# EAGLE design 12V_switching (EAGLE 7.7.0)
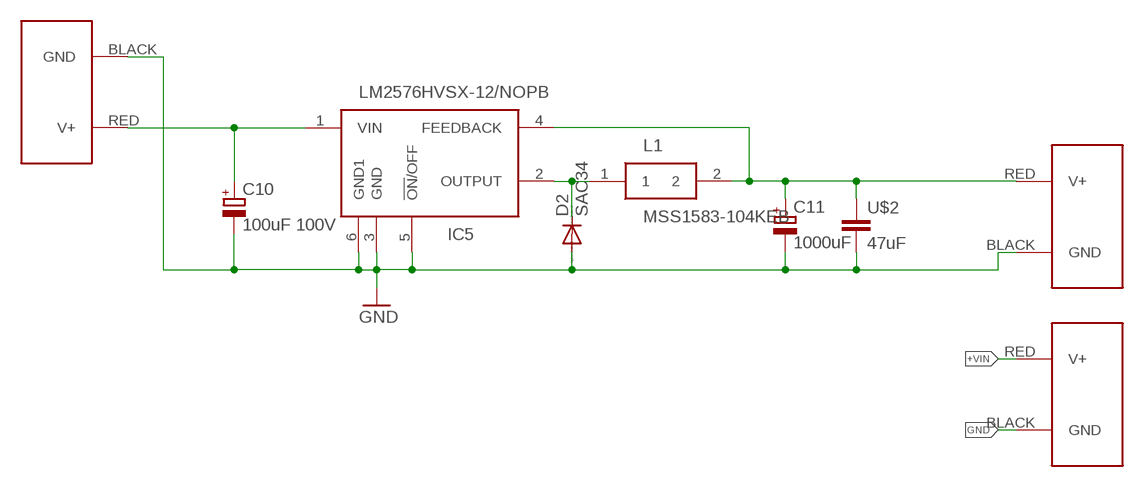
[diagram p0: schematic, sheet 1]

## Parts
C10  100uF 100V  CPOL-EU  [UD-10X10_NICHICON]
C11  1000uF  CPOL-EU  [UD-10X10_NICHICON]
D2  SAC34  DIODE-DO-214AC  [DO-214AC]
IC5  LM2576HVSX-12/NOPB  LM2576D2TR4-012G  [TO263-5]
J1  POWERPOLE_POWER45A  [POWERPOLE_PAIR_45A]
J2  POWERPOLE_POWER45A  [POWERPOLE_PAIR_45A]
J3  POWERPOLE_POWER45A  [POWERPOLE_PAIR_45A]
L1  MSS1583-104KEB  [INDPM150150X860N]
U$2  47uF  C-EU'1206'  [C1206]

## Nets
12VOUT: D2.C IC5.2(OUTPUT) L1.1
+12V: C11.+ IC5.4(FEEDBACK) J2.RED(V+) L1.2 U$2.1
+VIN [+12V]: C10.+ IC5.1(VIN) J1.RED(V+) J3.RED(V+)
GND: C10.- C11.- D2.A IC5.3(GND) IC5.5(!ON!/OFF) IC5.6(GND1) J1.BLACK(GND) J2.BLACK(GND) J3.BLACK(GND) U$2.2

## Library data of the parts
C10 C11 = rti:CPOL-EU
D2 = diode:DIODE-: DIODE
IC5 = LM2576:LM2576D2TR4-012G: Voltage Regulators - Switching Regulators 12V 3A Buck PWM Source: Datasheet <https://componentsearchengine.com/Datasheets/1/LM2576D2TR4-012G.pdf>; DESCRIPTION: Voltage Regulators - Switching Regulators 5V 3A Buck PWM; HEIGHT: mm; MANUFACTURER_NAME: ON Semiconductor; MANUFACTURER_PART_NUMBER: LM2576D2TR4-012G; MOUSER_PART_NUMBER: LM2576HVSX-12/NOPB; MOUSER_PRICE-STOCK: https://www.mouser.com/Search/Refine.aspx?Keyword=863-LM2576D2TR4-5G; MPN: LM2576HVSX-12/NOPB
J1-J3 = powerpoles:POWERPOLE_POWER: Anderson Powerpole Power Connector using ameteur radio standard layout
L1 = MSS1583-104KEB:MSS1583-104KEB: Fixed Inductors MSS1583 SMT Power 0.103Ohms 100uH Source: Datasheet <https://componentsearchengine.com/Datasheets/1/MSS1583-104KEB.pdf>; DESCRIPTION: Fixed Inductors MSS1583 SMT Power 0.103Ohms 100uH; HEIGHT: 8.6mm; MANUFACTURER_NAME: COILCRAFT; MANUFACTURER_PART_NUMBER: MSS1583-104KEB; MOUSER_PART_NUMBER: 994-MSS1583-104KEB; MOUSER_PRICE-STOCK: https://www.mouser.com/Search/Refine.aspx?Keyword=994-MSS1583-104KEB
U$2 = rti:C-EU

## Net classes
0 default: width 0.254 mm, drill 0.3 mm, clearance 0.203 mm
1 +12V: width 0.406 mm, drill 0.3 mm, clearance 0.203 mm
2 GND: width 0.254 mm, drill 0.3 mm, clearance 0.152 mm

## Board
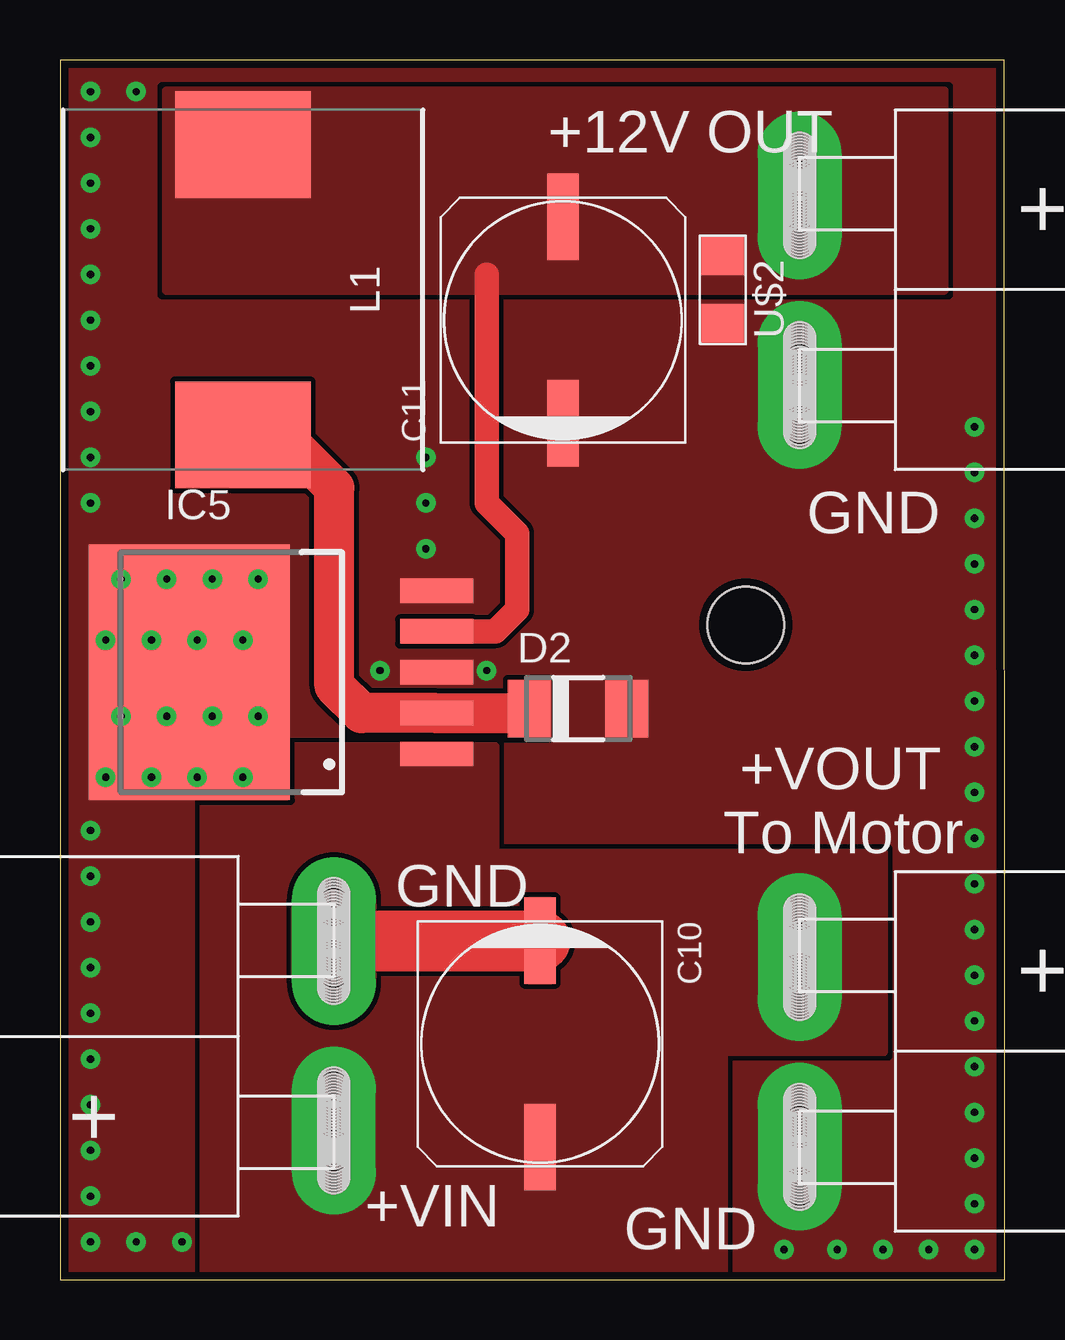
[diagram p1: board, top side]
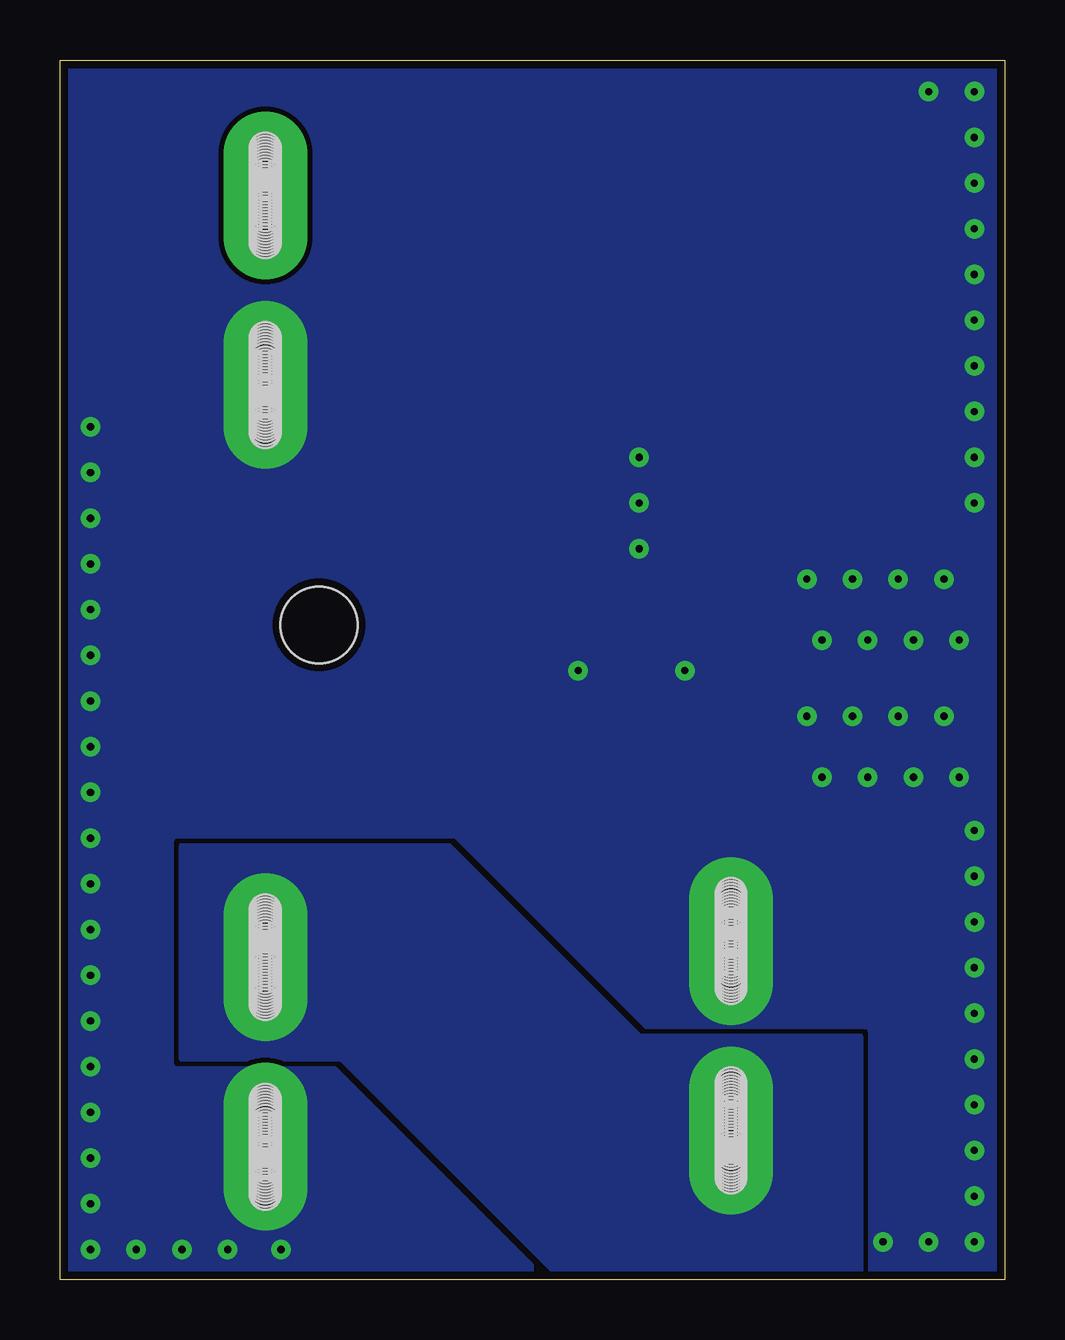
[diagram p2: board, bottom side, seen from below]

Size 39.37 x 50.85 mm. Coordinates in mm from the lower left corner, seen from the top.
Outline: 0,0 39.37,0 39.35,50.85 0,50.85 0,0
Copper layers (1*16): Top 0.1422mm / dielectric 1.6mm / Bottom 0.1422mm
Design rules "2layer *": minimum track width 8mil, minimum drill 0.3mm, track to track 8mil, track to pad 8mil, pad to pad 8mil, via to via 8mil, smd to smd 6mil, copper to edge 13mil, drill to drill 6mil, minimum pad ring 4mil, minimum via ring 4mil, stop-mask expansion 3mil, vias tented up to drill 130mil, thermal gap 8mil
Holes 3.2 mm at 28.57,27.3

### Footprints (pad centres in the part's own frame; a part is rotated, then mirrored left to right if it is on the bottom)
UD-10X10_NICHICON = smd 3.6 x 1.3: + 4.3,0; - -4.3,0
DO-214AC = smd 1.8 x 2.4: A 2.025,0; C -2.025,0
TO263-5 = smd 1.016 x 3.05: 1 -3.474,-8.71; 2 -1.772,-8.71; 3 -0.07,-8.71; 4 1.632,-8.71; 5 3.334,-8.71 | smd 10.66 x 8.38: 6 -0.07,1.595
POWERPOLE_PAIR_45A = drill 1.27 pad 3.5 long: BLACK 3.97,0.02; RED -3.93,0.02 | hole 1.27: -1.95,0.02; -5.91,0.02; 1.99,0.02; 5.95,0.02; -4.64,0.02; -3.37,0.02; 3.26,0.02; 4.68,0.02; -5.656,0.02; -5.783,0.02; -5.529,0.02; -5.402,0.02; -5.275,0.02; -5.148,0.02; -5.021,0.02; -4.894,0.02; -4.767,0.02; -2.077,0.02; -2.204,0.02; -2.331,0.02; -2.458,0.02; -2.585,0.02; -2.712,0.02; -2.966,0.02; -2.839,0.02; -3.093,0.02; -3.22,0.02; -3.497,0.02; -3.624,0.02; -3.751,0.02; -3.878,0.02; -4.005,0.02; -4.132,0.02; -4.259,0.02; -4.386,0.02; -4.513,0.02; 5.823,0.02; 5.696,0.02; 5.569,0.02; 5.442,0.02; 5.315,0.02; 5.188,0.02; 5.061,0.02; 4.934,0.02; 4.807,0.02; 4.553,0.02; 4.426,0.02; 4.299,0.02; 4.045,0.02; 4.045,0.02; 4.172,0.02; 3.918,0.02; 3.791,0.02; 3.791,0.02; 3.664,0.02; 3.664,0.02; 3.664,0.02; 3.537,0.02; 3.537,0.02; 3.41,0.02; 3.133,0.02; 3.006,0.02; 2.879,0.02; 2.752,0.02; 2.625,0.02; 2.498,0.02; 2.371,0.02; 2.244,0.02; 2.117,0.02
INDPM150150X860N = smd 4.45 x 5.65: 1 -6.05,0; 2 6.05,0
C1206 = smd 1.6 x 1.8: 1 -1.4,0; 2 1.4,0

### Placement (x,y rotation side)
C10  20,9.84 270 top
C11  20.95,40.01 90 top
D2  21.59,23.81 0 top
IC5  6.99,25.4 90 top
J1  11.43,10.16 90 top
J2  30.8,41.27 270 top
J3  30.8,9.53 270 top
L1  7.62,41.27 90 top
U$2  27.62,41.27 270 top

### Tracks (layer width: path | path; a pad name or v marks a point on that pad's centre or on a via)
12VOUT
  Top 1.676: L1.1 7.29,34.92 9.53,34.92 11.43,33.02 11.43,24.77 12.57,23.63 IC5.2 19.57,23.63 D2.C
+12V
  Top 1.016: IC5.4 18.14,27.03 19.05,27.94 19.05,31.11 17.78,32.38 17.78,41.91
  pour Top (no thermals): 4.45,41.27 36.83,41.27 36.83,49.53 4.45,49.53
+VIN
  pour Top (no thermals): 6.03,22.23 18.1,22.23 18.1,17.78 34.29,17.78 34.29,9.53 27.62,9.53 27.62,0 6.03,0
  pour Bottom: 34.29,18.1 23.18,18.1 15.24,10.16 6.03,10.16 6.03,0.32 18.73,0.32 27.62,9.21 34.29,9.21
GND  (via drill 0.3 pad 0.81)
  Top 2.54: C10.- 11.41,14.11 J1.BLACK
  other vias: 17.78,25.4 13.34,25.4 15.24,30.48 15.24,32.38 15.24,34.29 3.17,49.53 1.27,49.53 1.27,47.62 1.27,45.72 1.27,43.81 1.27,41.91 1.27,40.01 1.27,38.1 1.27,36.2 1.27,34.29 1.27,32.38 2.54,29.21 4.45,29.21 6.35,29.21 8.26,29.21 7.62,26.67 5.71,26.67 3.81,26.67 1.91,26.67 2.54,23.5 4.45,23.5 6.35,23.5 8.26,23.5 7.62,20.95 5.71,20.95 3.81,20.95 1.91,20.95 38.1,35.56 38.1,33.66 38.1,31.75 38.1,29.84 38.1,27.94 38.1,26.04 38.1,24.13 38.1,22.23 38.1,20.32 38.1,18.41 38.1,16.51 38.1,14.61 38.1,12.7 38.1,10.79 38.1,8.89 38.1,6.99 38.1,5.08 38.1,3.17 38.1,1.27 36.2,1.27 3.17,1.59 5.08,1.59 30.16,1.27 32.38,1.27 34.29,1.27 1.27,18.73 1.27,16.83 1.27,14.92 1.27,13.02 1.27,11.11 1.27,9.21 1.27,7.3 1.27,5.4 1.27,3.49 1.27,1.59
  pour Bottom (rank 2, no thermals): 0,0 0,50.8 39.37,50.8 39.37,0
  pour Top (rank 2, no thermals): 0,0 0,50.8 39.37,50.8 39.37,0

### Text on the board
tPlace: +VOUT / To Motor
tNames: +12V OUT | GND | GND | +VIN | GND